# Altium project RAK4200.PrjPcb
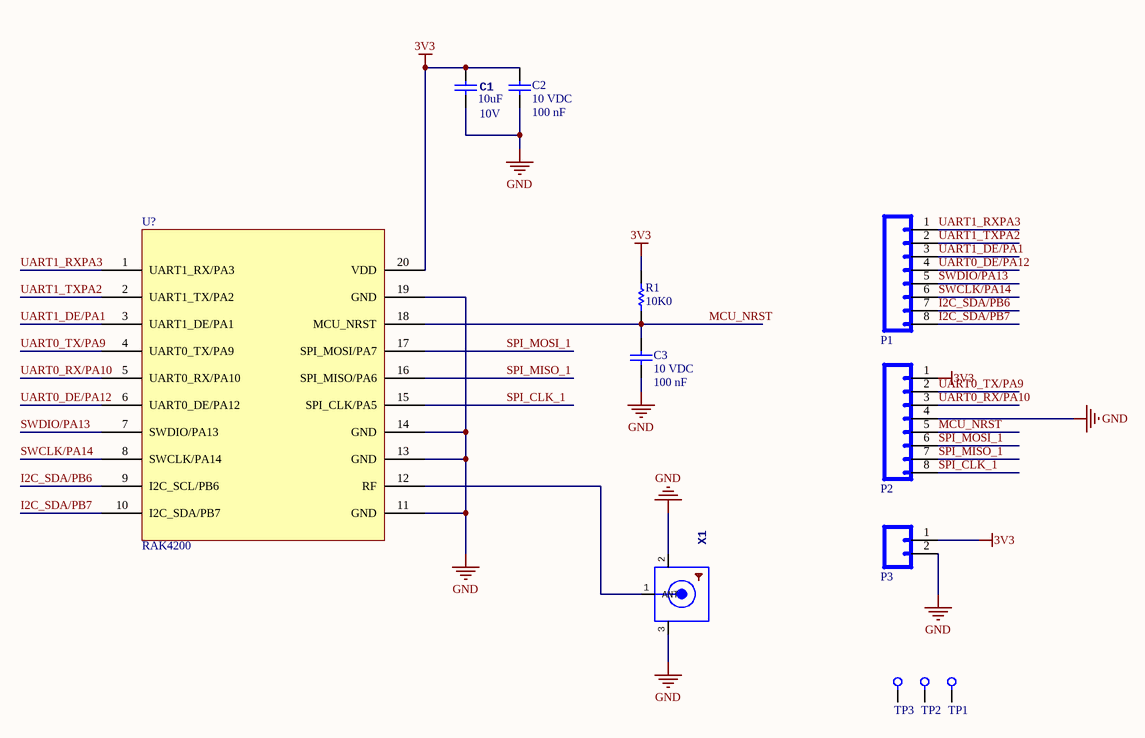
[diagram p0: RAK4200.SchDoc]
1 sheet, 12 parts. Net scope: global (net labels, ports and power ports of the same name join across sheets).
Board file: RAK4200.PcbDoc

## Sheet RAK4200.SchDoc
size Letter; Engineer: IVAN DANIEL CRUZ GARCIA; Revision: A; SheetNumber: 1; SheetTotal: 1; Proyecto: Veramedic

### Parts
C1  Capacitance: 10uF  Voltage Rating DC: 10V  [C0402]  (hidden comment: ZRB15XR61A106ME01D)
C2  Voltage Rating DC: 10 VDC  Capacitance - nF: 100 nF  [C0402]  (hidden comment: 100nF, 10 V)
C3  Voltage Rating DC: 10 VDC  Capacitance - nF: 100 nF  [C0402]  (hidden comment: 100nF, 10 V)
P1  68000-236HLF  [HEADER1X8]  (value not drawn)
P2  68000-236HLF  [HEADER1X8]  (value not drawn)
P3  452-00009  [HDR1X2]  (value not drawn)
R1  value 10K0  [0402_RES]  (hidden comment: CRCW040210K0FKTD)
TP1  TestPoint-SMD-1MM  [TestPoint - SMD_1mm]  (value not drawn)
TP2  TestPoint-SMD-1MM  [TestPoint - SMD_1mm]  (value not drawn)
TP3  TestPoint-SMD-1MM  [TestPoint - SMD_1mm]  (value not drawn)
U?  RAK4200  [RAK4200]
X1  RECE.20279.001E.01  [U.FL]  (value not drawn)

### Nets
3V3: C1.1 C2.1 P2.1 P3.1 R1.2 U?.20(VDD)
GND: C1.2 C2.2 C3.2 P2.4 P3.2 U?.11(GND) U?.13(GND) U?.14(GND) U?.19(GND) X1.2(GND) X1.3(GND)
I2C_SDA/PB6: P1.7 U?.9(I2C_SCL/PB6)
I2C_SDA/PB7: P1.8 U?.10(I2C_SDA/PB7)
MCU_NRST: C3.1 P2.5 R1.1 U?.18(MCU_NRST)
SPI_CLK_1: P2.8 U?.15(SPI_CLK/PA5)
SPI_MISO_1: P2.7 U?.16(SPI_MISO/PA6)
SPI_MOSI_1: P2.6 U?.17(SPI_MOSI/PA7)
SWCLK/PA14: P1.6 U?.8(SWCLK/PA14)
SWDIO/PA13: P1.5 U?.7(SWDIO/PA13)
UART0_DE/PA12: P1.4 U?.6(UART0_DE/PA12)
UART0_RX/PA10: P2.3 U?.5(UART0_RX/PA10)
UART0_TX/PA9: P2.2 U?.4(UART0_TX/PA9)
UART1_DE/PA1: P1.3 U?.3(UART1_DE/PA1)
UART1_RXPA3: P1.1 U?.1(UART1_RX/PA3)
UART1_TXPA2: P1.2 U?.2(UART1_TX/PA2)
NetU?_12: U?.12(RF) X1.1(ANT)

Not connected (* = marked no-connect by the designer): TP1 1; TP2 1; TP3 1

### Notes on the sheet
- Proyecto:
- CENTRO DE INGENIERIA Y DESARROLLO INDUSTRIAL
- Titulo:
- Fecha:
- Hoja:
- Elaborado por:
- de
- Hora:
- Revisión:
- Revisado por:
- CIDESI_template_letter

### Library data of the parts
C1 = 10uF, 10V: Cap_Cer; Manufacturer: Murata Electronics; Tolerance: 20 %; Type: General Purpose Multilayer Ceramic Chip Capacitor; Class: Class 2; Dielectric: X5R; Supplier 1: Mouser; Manufacturer Part Number: ZRB15XR61A106ME01D; RoHS: RoHS Compliant; Category: Multilayer Ceramic Capacitors MLCC - SMD/SMT; Stock 1: 361820; Pricing 1: 1=0.624, 10=0.436, 100=0.261, 500=0.196, 1000=0.165, 2500=0.137, 5000=0.129, 8000=0.117, 24000=0.113 (MXN); Height: 0.65 mm; Length: 1 mm; Package / Case: 0402 (1005 metric); Packaging: Cut Tape; Product: General Type MLCCs; Series: ZRB; Termination Style: SMD/SMT; Width: 0.5 mm; Brand: Murata Electronics; Case Code - in: 0402; Case Code - mm: 1005; Maximum Operating Temperature: + 85 C; Minimum Operating Temperature: - 55 C; Product Type: Ceramic Capacitors; Standard Pack Qty: 8000; Subcategory: Capacitors; Termination: Interposer Substrate; RoHS - Mouser: Y; Minimum Order Quantity: 1; Reeling: True; ComponentLink1URL: https://www.mouser.com/datasheet/2/281/ZRB15XR61A106ME01-01-1771691.pdf; ComponentLink1Description: https://www.mouser.com/datasheet/2/281/ZRB15XR61A106ME01-01-1771691.pdf; Supplier Part Number 1: 81-ZRB15XR61A106ME1D
C2 C3 = 100nF, 10 V: Cap_Cer; Manufacturer: Murata Electronics; Manufacturer Part Number: GRM155R71A104KA01D; Capacitance: 0.1 uF; Tolerance: 10 %; Type: General Purpose MLCC; Capacitance - pF: 100000 pF; Dielectric: X7R; Qualification: Commercial; Supplier 1: Mouser; RoHS: RoHS Compliant; Category: Multilayer Ceramic Capacitors MLCC - SMD/SMT; Stock 1: 259611; Pricing 1: 1=0.100, 10=0.006, 100=0.004, 500=0.003, 10000=0.003 (USD); Height: 0.5 mm; Length: 1 mm; Package / Case: 0402 (1005 metric); Packaging: Reel; Product: General Type MLCCs; Series: GRM; Termination Style: SMD/SMT; Width: 0.5 mm; Brand: Murata Electronics; Case Code - in: 0402; Case Code - mm: 1005; Maximum Operating Temperature: + 125 C; Minimum Operating Temperature: - 55 C; Standard Pack Qty: 10000; RoHS - Mouser: Y; Minimum Order Quantity: 1; Reeling: True; ComponentLink1URL: http://www.mouser.com/ds/2/281/c02e-2905.pdf; ComponentLink1Description: http://www.mouser.com/ds/2/281/c02e-2905.pdf; Supplier Part Number 1: 81-GRM155R71A104KA1D
P1 P2 = HEADER 1X8: Manufacturer: Amphenol FCI; Current Rating: 3 A; Mounting Angle: Straight; Number of Positions: 36 Position; Voltage Rating: 1.5 kV; Pitch: 2.54 mm; Insulation Resistance: 5 GOhms; Mating Post Length: 5.84 mm; Supplier 1: Mouser; Manufacturer Part Number: 68000-236HLF; RoHS: RoHS Compliant; Category: Headers & Wire Housings; Stock 1: 1164; Pricing 1: 1=1.89, 10=1.65, 100=1.47, 200=1.42, 500=1.23, 1000=1.00 (MXN); Contact Plating: Gold; Housing Material: Thermoplastic (TP); Number of Rows: 1 Row; Packaging: Bulk; Product: Headers; Termination Style: Solder Pin; Type: Pin Strip; Brand: Amphenol FCI; Contact Material: Phosphor Bronze; Flammability Rating: UL 94 V-0; Mounting Style: -; Contact Gender: Pin (Male); Housing Color: Black; Housing Gender: -; Maximum Operating Temperature: + 125 C; Minimum Operating Temperature: - 65 C; Product Type: Headers & Wire Housings; Standard Pack Qty: 100; Subcategory: Headers & Wire Housings; Termination Post Length: 2.41 mm; Tradename: BergStik; RoHS - Mouser: Y; Minimum Order Quantity: 1; Reeling: False; ComponentLink1URL: https://www.mouser.com/datasheet/2/18/68000-1266375.pdf; ComponentLink1Description: https://www.mouser.com/datasheet/2/18/68000-1266375.pdf; Supplier Part Number 1: 649-68000-236HLF
P3 = HEADER1X2: Manufacturer: Parallax; Accessory Type: Jumper (Shunt); Mounting Angle: Straight; Number of Positions: 2 Position; Pitch: 2.54 mm; Latching Type: Unlatched; Supplier 1: Mouser; Manufacturer Part Number: 452-00009; RoHS: RoHS Compliant; Category: Headers & Wire Housings; Stock 1: 900; Pricing 1: 1=1.29, 5=1.28 (MXN); Number of Rows: 1 Row; Product: Accessories; Type: -; Brand: Parallax; Product Type: Headers & Wire Housings; Standard Pack Qty: 1; Subcategory: Headers & Wire Housings; RoHS - Mouser: Y; Minimum Order Quantity: 1; Reeling: False; Supplier Part Number 1: 619-452-00009
R1 = 10K0, 63 mW: Resistor; Manufacturer 1: VISHAY DALE; Supplier 1: Newark; Manufacturer Part Number: CRCW040210K0FKTD; RoHS: NO; Stock 1: 12163; Pricing 1: 1=0.073, 10=0.039, 100=0.023, 1000=0.019 (USD); ComponentLink1URL: http://www.farnell.com/datasheets/1914725.pdf; ComponentLink1Description: http://www.farnell.com/datasheets/1914725.pdf; Supplier Part Number 1: 96C9543
TP1-TP3 = TestPoint-SMD-1MM: TestPoint-SMD; Manufacturer: Keystone Electronics; Manufacturer Part Number: 5000; Mounting Hole Size: 1 mm; Outside Diameter: 2.54 mm; Plating: Silver; Supplier 1: Mouser; RoHS: RoHS Compliant; Category: Circuit Board Hardware - PCB; Stock 1: 104084; Pricing 1: 1=0.416, 10=0.389, 50=0.295, 100=0.281, 250=0.255, 500=0.241, 1000=0.200, 3000=0.192, 6000=0.174 (MXN); Color: Red; Length: 7.62 mm; Material: Nylon; Packaging: Bulk; Product: Test Points; Type: Miniature; Brand: Keystone Electronics; Contact Material: Phosphor Bronze; Product Type: Circuit Board Hardware - PCB; Standard Pack Qty: 100; Subcategory: Hardware; RoHS - Mouser: Y; Minimum Order Quantity: 1; Reeling: False; ComponentLink1URL: http://www.mouser.com/datasheet/2/215/000-5004-741320.pdf; ComponentLink1Description: http://www.mouser.com/datasheet/2/215/000-5004-741320.pdf; Supplier Part Number 1: 534-5000
U? = RAK4200: MODULO LORA; Manufacturer 1: RAK; Manufacturer Part Number: RAK4200 LoRa® Module - US915; ComponentLink1URL: https://store.rakwireless.com/products/rak4200-lora-module?variant=36313266356382; Part Number: RAK4200
X1 = SMACONNECTOR_UFL: Connector UFL; Manufacturer: Taoglas; Supplier 1: Mouser; Manufacturer Part Number: RECE.20279.001E.01; RoHS: RoHS Compliant; Category: RF Connectors / Coaxial Connectors; Stock 1: 0; Brand: Taoglas; Product Type: RF Connectors / Coaxial Connectors; Subcategory: RF Interconnects; Minimum Order Quantity: 1; Reeling: False; Supplier Part Number 1: N/A